# EAGLE schematic crystal-test (EAGLE 6.4)
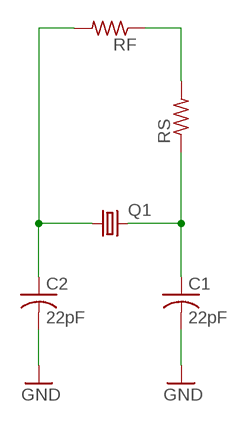
[diagram p0: schematic, sheet 1]

## Parts
C1  22pF  CAPACITORC1206K  [C1206K]
C2  22pF  CAPACITORC1206K  [C1206K]
Q1  CRYSTALTC26V  [TC26V]
RF  RESISTORR1206  [R1206]
RS  RESISTORR1206  [R1206]

## Nets
C1: C1.1 Q1.2 RS.1
GND: C1.2 C2.2
N$1: C2.1 Q1.1 RF.2
N$3: RF.1 RS.2

## Library data of the parts
C1 C2 = iStivi - RCLD:CAPACITOR: CAPACITOR, American symbol
Q1 = iStivi - Oscillators:CRYSTAL: CRYSTAL; OC_FARNELL: unknown; OC_NEWARK: unknown
RF RS = iStivi - RCLD:RESISTOR: RESISTOR